# EAGLE schematic Pure Sequencer (EAGLE 8.7.0)
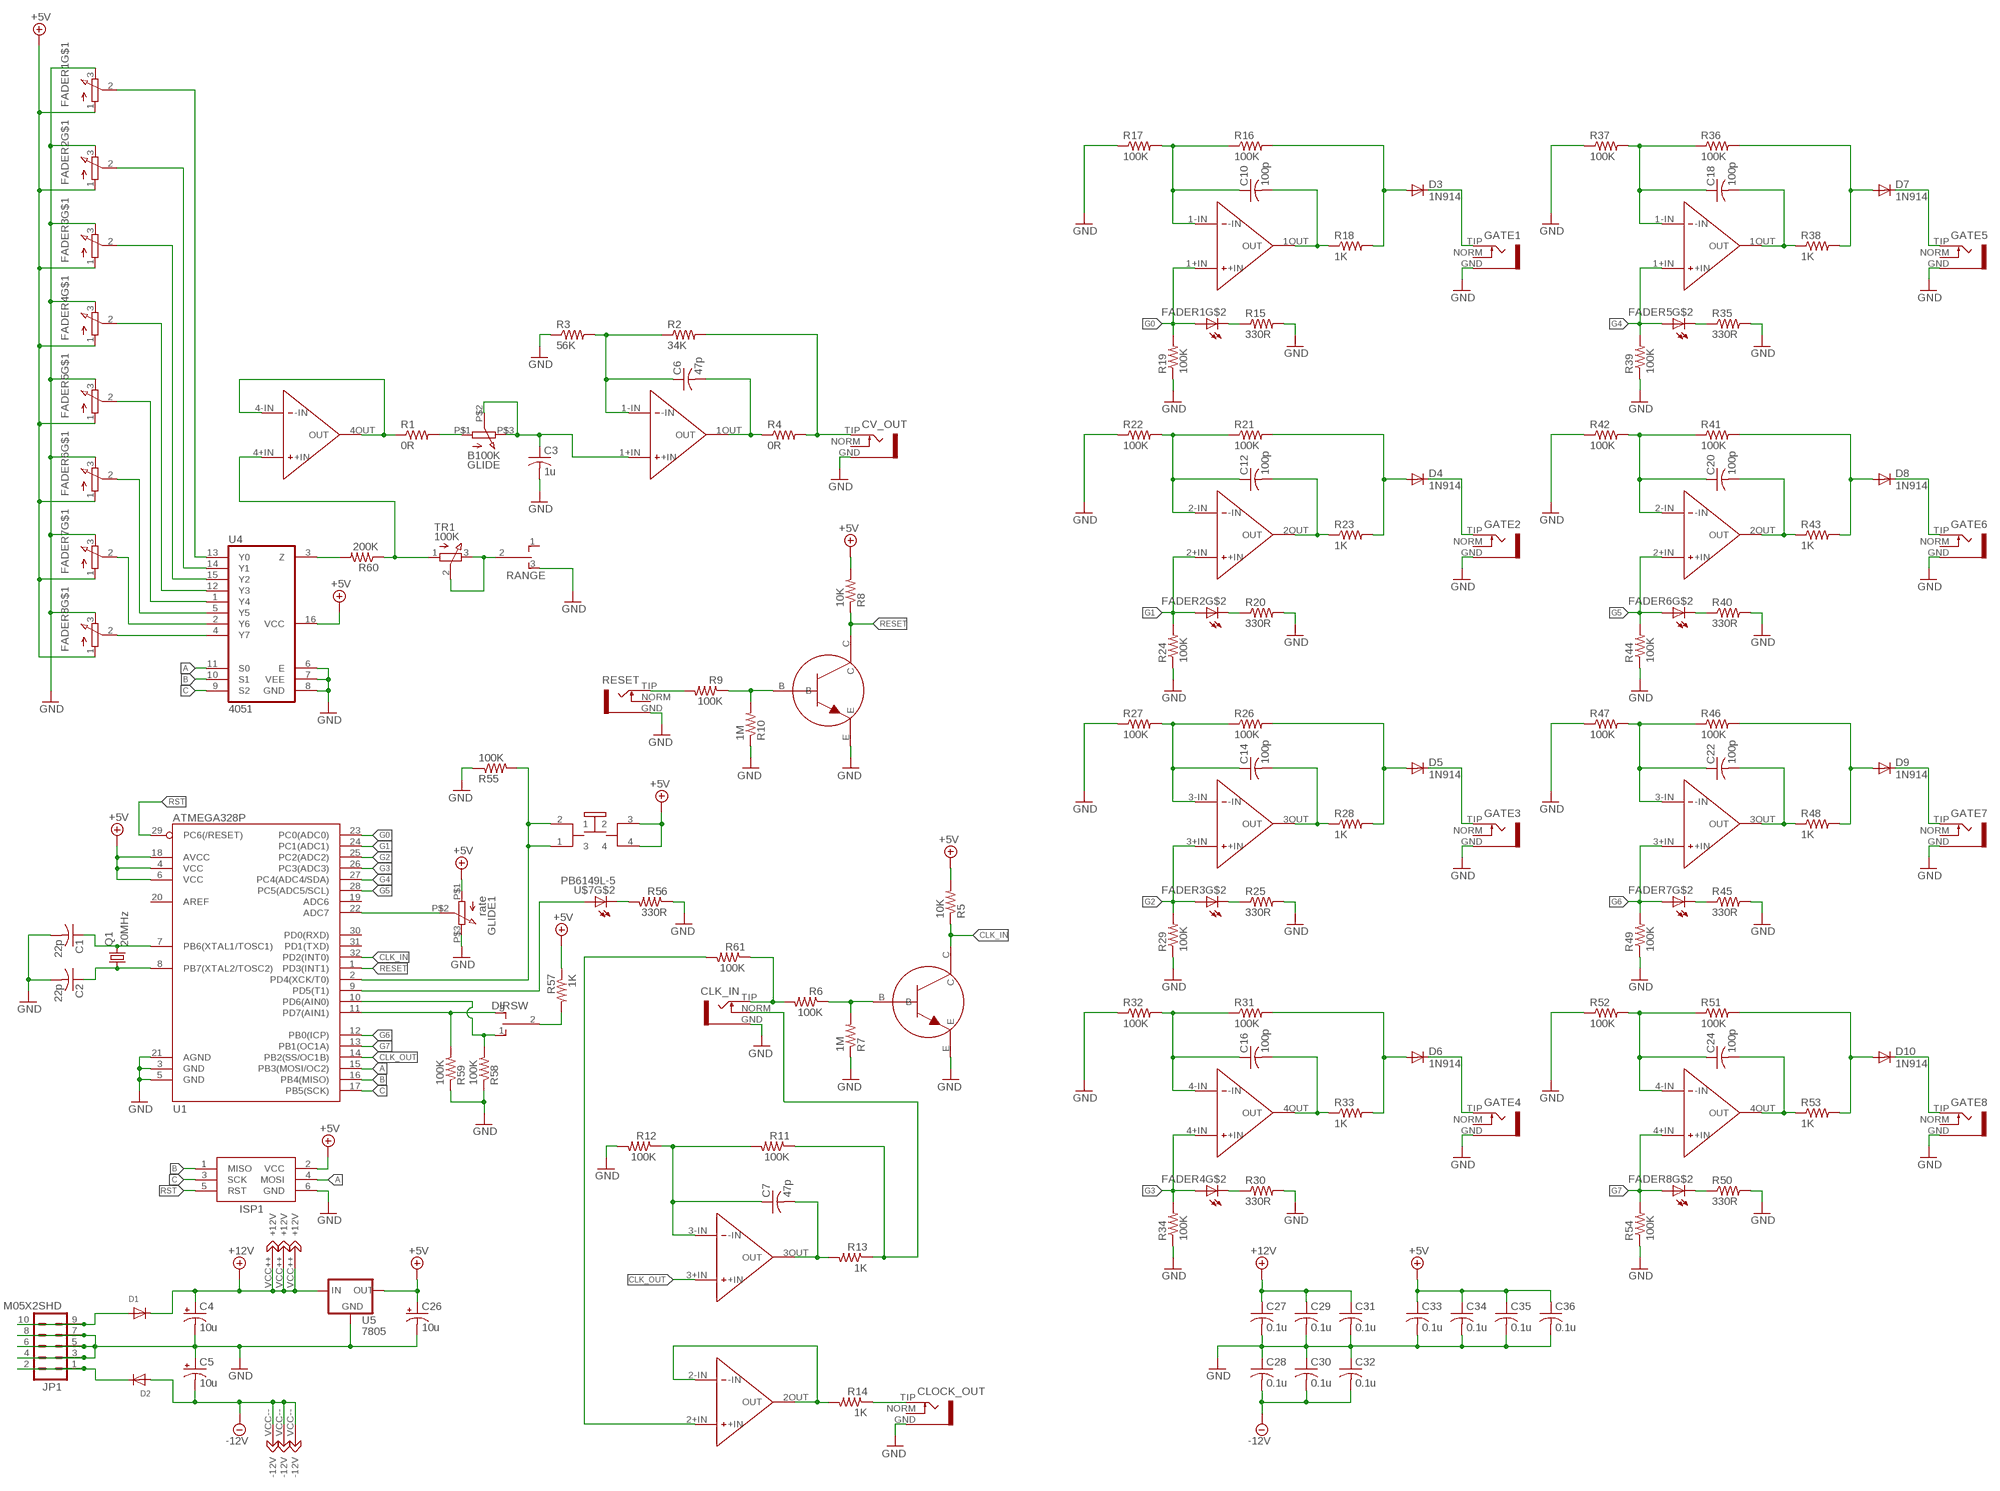
[diagram p0: schematic, sheet 1]

## Parts
C1  22p  C-USC0805K  [C0805K]
C2  22p  C-USC0805K  [C0805K]
C3  1u  C-USC0805K  [C0805K]
C4  10u  CPOL-US153CLV-0505  [153CLV-0505]
C5  10u  CPOL-US153CLV-0505  [153CLV-0505]
C6  47p  C-USC0805K  [C0805K]
C7  47p  C-USC0805K  [C0805K]
C10  100p  C-USC0805K  [C0805K]
C12  100p  C-USC0805K  [C0805K]
C14  100p  C-USC0805K  [C0805K]
C16  100p  C-USC0805K  [C0805K]
C18  100p  C-USC0805K  [C0805K]
C20  100p  C-USC0805K  [C0805K]
C22  100p  C-USC0805K  [C0805K]
C24  100p  C-USC0805K  [C0805K]
C26  10u  CPOL-US153CLV-0505  [153CLV-0505]
C27  0.1u  C-USC0805K  [C0805K]
C28  0.1u  C-USC0805K  [C0805K]
C29  0.1u  C-USC0805K  [C0805K]
C30  0.1u  C-USC0805K  [C0805K]
C31  0.1u  C-USC0805K  [C0805K]
C32  0.1u  C-USC0805K  [C0805K]
C33  0.1u  C-USC0805K  [C0805K]
C34  0.1u  C-USC0805K  [C0805K]
C35  0.1u  C-USC0805K  [C0805K]
C36  0.1u  C-USC0805K  [C0805K]
CLK_IN  S_JACK  [S_JACK]
CLOCK_OUT  S_JACK  [S_JACK]
CV_OUT  S_JACK  [S_JACK]
D1  DIODESMA  [SMADIODE]
D2  DIODESMA  [SMADIODE]
D3  1N914  DIODESOD  [SOD-323]
D4  1N914  DIODESOD  [SOD-323]
D5  1N914  DIODESOD  [SOD-323]
D6  1N914  DIODESOD  [SOD-323]
D7  1N914  DIODESOD  [SOD-323]
D8  1N914  DIODESOD  [SOD-323]
D9  1N914  DIODESOD  [SOD-323]
D10  1N914  DIODESOD  [SOD-323]
DIRSW  TOGGLE_ON_OFF_ON  [TOGGLE_ON_OFF_ON]
FADER1  LED_FADER  [LED_FADER]
FADER2  LED_FADER  [LED_FADER]
FADER3  LED_FADER  [LED_FADER]
FADER4  LED_FADER  [LED_FADER]
FADER5  LED_FADER  [LED_FADER]
FADER6  LED_FADER  [LED_FADER]
FADER7  LED_FADER  [LED_FADER]
FADER8  LED_FADER  [LED_FADER]
GATE1  S_JACK  [S_JACK]
GATE2  S_JACK  [S_JACK]
GATE3  S_JACK  [S_JACK]
GATE4  S_JACK  [S_JACK]
GATE5  S_JACK  [S_JACK]
GATE6  S_JACK  [S_JACK]
GATE7  S_JACK  [S_JACK]
GATE8  S_JACK  [S_JACK]
GLIDE  B100K  Q-POT  [Q-POT]
GLIDE1  rate  Q-POT  [Q-POT]
ISP1  AVRISP-6  [AVRISP]
JP1  M05X2SHD  [2X5-SHROUDED]
Q1  20MHz  CRYSTALHC49UP  [HC49UP]
R1  0R  R-US_R0805  [R0805]
R2  34K  R-US_R0805  [R0805]
R3  56K  R-US_R0805  [R0805]
R4  0R  R-US_R0805  [R0805]
R5  10K  R-US_R0805  [R0805]
R6  100K  R-US_R0805  [R0805]
R7  1M  R-US_R0805  [R0805]
R8  10K  R-US_R0805  [R0805]
R9  100K  R-US_R0805  [R0805]
R10  1M  R-US_R0805  [R0805]
R11  100K  R-US_R0805  [R0805]
R12  100K  R-US_R0805  [R0805]
R13  1K  R-US_R0805  [R0805]
R14  1K  R-US_R0805  [R0805]
R15  330R  R-US_R0805  [R0805]
R16  100K  R-US_R0805  [R0805]
R17  100K  R-US_R0805  [R0805]
R18  1K  R-US_R0805  [R0805]
R19  100K  R-US_R0805  [R0805]
R20  330R  R-US_R0805  [R0805]
R21  100K  R-US_R0805  [R0805]
R22  100K  R-US_R0805  [R0805]
R23  1K  R-US_R0805  [R0805]
R24  100K  R-US_R0805  [R0805]
R25  330R  R-US_R0805  [R0805]
R26  100K  R-US_R0805  [R0805]
R27  100K  R-US_R0805  [R0805]
R28  1K  R-US_R0805  [R0805]
R29  100K  R-US_R0805  [R0805]
R30  330R  R-US_R0805  [R0805]
R31  100K  R-US_R0805  [R0805]
R32  100K  R-US_R0805  [R0805]
R33  1K  R-US_R0805  [R0805]
R34  100K  R-US_R0805  [R0805]
R35  330R  R-US_R0805  [R0805]
R36  100K  R-US_R0805  [R0805]
R37  100K  R-US_R0805  [R0805]
R38  1K  R-US_R0805  [R0805]
R39  100K  R-US_R0805  [R0805]
R40  330R  R-US_R0805  [R0805]
R41  100K  R-US_R0805  [R0805]
R42  100K  R-US_R0805  [R0805]
R43  1K  R-US_R0805  [R0805]
R44  100K  R-US_R0805  [R0805]
R45  330R  R-US_R0805  [R0805]
R46  100K  R-US_R0805  [R0805]
R47  100K  R-US_R0805  [R0805]
R48  1K  R-US_R0805  [R0805]
R49  100K  R-US_R0805  [R0805]
R50  330R  R-US_R0805  [R0805]
R51  100K  R-US_R0805  [R0805]
R52  100K  R-US_R0805  [R0805]
R53  1K  R-US_R0805  [R0805]
R54  100K  R-US_R0805  [R0805]
R55  100K  R-US_R0805  [R0805]
R56  330R  R-US_R0805  [R0805]
R57  1K  R-US_R0805  [R0805]
R58  100K  R-US_R0805  [R0805]
R59  100K  R-US_R0805  [R0805]
R60  200K  R-US_R0805  [R0805]
R61  100K  R-US_R0805  [R0805]
RANGE  TOGGLE_ON_OFF_ON  [TOGGLE_ON_OFF_ON]
RESET  S_JACK  [S_JACK]
T1  2N3904  TRANSISTOR_MMBT3904  [TRANSISTOR_SINGLE_N-TYPE]
T2  2N3904  TRANSISTOR_MMBT3904  [TRANSISTOR_SINGLE_N-TYPE]
TR1  100K  TRIMMER_TH3  [TRIMMER_TH3]
U1  ATMEGA328P  ATMEGA328_SMT  [TQFP32-08]
U2  QUAD_OPAMP  [QUAD_OPAMP]
U3  QUAD_OPAMP  [QUAD_OPAMP]
U4  4051  MUX!  [N2222_ARRAY]
U5  7805  V-REG  [V-REG]
U6  QUAD_OPAMP  [QUAD_OPAMP]
U$7  PB6149L-5  [PB6149L]

## Nets
+5V: C26.+ C33.1 C34.1 C35.1 C36.1 FADER1.1 FADER2.1 FADER3.1 FADER4.1 FADER5.1 FADER6.1 FADER7.1 FADER8.1 GLIDE1.P$1 ISP1.2(VCC) R5.2 R8.2 R57.1 U1.4(VCC) U1.6(VCC) U1.18(AVCC) U4.16(VCC) U5.3(OUT) U$7.3 U$7.4
+12V: C4.+ C27.1 C29.1 C31.1 D1.C U2.VCC++(+12V) U3.VCC++(+12V) U5.1(IN) U6.VCC++(+12V)
-12V: C5.- C28.2 C30.2 C32.2 D2.A U2.VCC--(-12V) U3.VCC--(-12V) U6.VCC--(-12V)
A: ISP1.4(MOSI) U1.15(PB3(MOSI/OC2)) U4.11(S0)
B: ISP1.1(MISO) U1.16(PB4(MISO)) U4.10(S1)
C: ISP1.3(SCK) U1.17(PB5(SCK)) U4.9(S2)
CLK_IN: R5.1 T1.C U1.32(PD2(INT0))
CLK_OUT: U1.14(PB2(SS/OC1B)) U6.3+IN(+IN)
G0: FADER1.A R19.2 U1.23(PC0(ADC0)) U2.1+IN(+IN)
G1: FADER2.A R24.2 U1.24(PC1(ADC1)) U2.2+IN(+IN)
G2: FADER3.A R29.2 U1.25(PC2(ADC2)) U2.3+IN(+IN)
G3: FADER4.A R34.2 U1.26(PC3(ADC3)) U2.4+IN(+IN)
G4: FADER5.A R39.2 U1.27(PC4(ADC4/SDA)) U3.1+IN(+IN)
G5: FADER6.A R44.2 U1.28(PC5(ADC5/SCL)) U3.2+IN(+IN)
G6: FADER7.A R49.2 U1.12(PB0(ICP)) U3.3+IN(+IN)
G7: FADER8.A R54.2 U1.13(PB1(OC1A)) U3.4+IN(+IN)
GND: C1.2 C2.2 C3.2 C4.- C5.+ C26.- C27.2 C28.1 C29.2 C30.1 C31.2 C32.1 C33.2 C34.2 C35.2 C36.2 CLK_IN.GND CLOCK_OUT.GND CV_OUT.GND FADER1.3 FADER2.3 FADER3.3 FADER4.3 FADER5.3 FADER6.3 FADER7.3 FADER8.3 GATE1.GND GATE2.GND GATE3.GND GATE4.GND GATE5.GND GATE6.GND GATE7.GND GATE8.GND GLIDE1.P$3 ISP1.6(GND) JP1.3 JP1.4 JP1.5 JP1.6 JP1.7 JP1.8 R3.1 R7.1 R10.1 R12.2 R15.2 R17.1 R19.1 R20.2 R22.1 R24.1 R25.2 R27.1 R29.1 R30.2 R32.1 R34.1 R35.2 R37.1 R39.1 R40.2 R42.1 R44.1 R45.2 R47.1 R49.1 R50.2 R52.1 R54.1 R55.1 R56.1 R58.1 R59.1 RANGE.3(S) RESET.GND T1.E T2.E U1.3(GND) U1.5(GND) U1.21(AGND) U4.6(E) U4.7(VEE) U4.8(GND) U5.4(GND)
N$1: C1.1 Q1.2 U1.7(PB6(XTAL1/TOSC1))
N$2: C2.1 Q1.1 U1.8(PB7(XTAL2/TOSC2))
N$3: R60.1 TR1.1 U6.4+IN(+IN)
N$4: R1.1 U6.4-IN(-IN) U6.4OUT(OUT)
N$5: GLIDE.P$1 R1.2
N$6: FADER8.2 U4.4(Y7)
N$7: FADER7.2 U4.2(Y6)
N$8: FADER6.2 U4.5(Y5)
N$9: D1.A JP1.9 JP1.10
N$10: D2.C JP1.1 JP1.2
N$11: FADER5.2 U4.1(Y4)
N$12: FADER4.2 U4.12(Y3)
N$13: FADER3.2 U4.15(Y2)
N$14: FADER2.2 U4.14(Y1)
N$15: FADER1.2 U4.13(Y0)
N$16: C3.1 GLIDE.P$2 GLIDE.P$3 U6.1+IN(+IN)
N$17: R6.1 R7.2 T1.B
N$18: R61.2 U6.2+IN(+IN)
N$19: C6.1 R2.1 R3.2 U6.1-IN(-IN)
N$20: C6.2 R4.1 U6.1OUT(OUT)
N$21: CV_OUT.TIP R2.2 R4.2
N$22: R9.1 R10.2 T2.B
N$23: R9.2 RESET.TIP
N$24: C7.1 R11.2 R12.1 U6.3-IN(-IN)
N$25: C7.2 R13.2 U6.3OUT(OUT)
N$26: CLK_IN.TIP R6.2 R61.1
N$27: R14.2 U6.2-IN(-IN) U6.2OUT(OUT)
N$28: CLOCK_OUT.TIP R14.1
N$29: CLK_IN.NORM R11.1 R13.1
N$30: GLIDE1.P$2 U1.22(ADC7)
N$31: FADER1.K(C) R15.1
N$32: C10.1 R16.1 R17.2 U2.1-IN(-IN)
N$33: C10.2 R18.1 U2.1OUT(OUT)
N$34: D3.2(A) R16.2 R18.2
N$35: FADER3.K(C) R25.1
N$36: FADER2.K(C) R20.1
N$37: C12.1 R21.1 R22.2 U2.2-IN(-IN)
N$38: C12.2 R23.1 U2.2OUT(OUT)
N$39: D4.2(A) R21.2 R23.2
N$40: C14.1 R26.1 R27.2 U2.3-IN(-IN)
N$41: C14.2 R28.1 U2.3OUT(OUT)
N$42: D5.2(A) R26.2 R28.2
N$43: FADER4.K(C) R30.1
N$44: C16.1 R31.1 R32.2 U2.4-IN(-IN)
N$45: C16.2 R33.1 U2.4OUT(OUT)
N$46: D6.2(A) R31.2 R33.2
N$47: FADER5.K(C) R35.1
N$48: C18.1 R36.1 R37.2 U3.1-IN(-IN)
N$49: C18.2 R38.1 U3.1OUT(OUT)
N$50: D7.2(A) R36.2 R38.2
N$51: FADER6.K(C) R40.1
N$52: C20.1 R41.1 R42.2 U3.2-IN(-IN)
N$53: C20.2 R43.1 U3.2OUT(OUT)
N$54: D8.2(A) R41.2 R43.2
N$55: FADER7.K(C) R45.1
N$56: C22.1 R46.1 R47.2 U3.3-IN(-IN)
N$57: C22.2 R48.1 U3.3OUT(OUT)
N$58: D9.2(A) R46.2 R48.2
N$59: FADER8.K(C) R50.1
N$60: C24.1 R51.1 R52.2 U3.4-IN(-IN)
N$61: C24.2 R53.1 U3.4OUT(OUT)
N$62: D10.2(A) R51.2 R53.2
N$63: R55.2 U1.2(PD4(XCK/T0)) U$7.1 U$7.2
N$64: U1.9(PD5(T1)) U$7.A
N$65: R56.2 U$7.K(C)
N$66: DIRSW.2(P) R57.2
N$67: DIRSW.1(O) R58.2 U1.10(PD6(AIN0))
N$68: DIRSW.3(S) R59.2 U1.11(PD7(AIN1))
N$69: R60.2 U4.3(Z)
N$70: RANGE.2(P) TR1.2 TR1.3
N$71: D6.1(C) GATE4.TIP
N$72: D5.1(C) GATE3.TIP
N$73: D4.1(C) GATE2.TIP
N$74: D3.1(C) GATE1.TIP
N$75: D10.1(C) GATE8.TIP
N$76: D9.1(C) GATE7.TIP
N$77: D8.1(C) GATE6.TIP
N$78: D7.1(C) GATE5.TIP
RESET: R8.1 T2.C U1.1(PD3(INT1))
RST: ISP1.5(RST) U1.29(PC6(/RESET))
Unconnected: CLOCK_OUT.NORM CV_OUT.NORM GATE1.NORM GATE2.NORM GATE3.NORM GATE4.NORM GATE5.NORM GATE6.NORM GATE7.NORM GATE8.NORM RANGE.1(O) RESET.NORM U1.19(ADC6) U1.20(AREF) U1.30(PD0(RXD)) U1.31(PD1(TXD))

## Library data of the parts
C1-C3 C6 C7 C10 C12 C14 C16 C18 C20 C22 C24 C27-C36 = rcl:C-US: CAPACITOR, American symbol
C4 C5 C26 = rcl:CPOL-US: POLARIZED CAPACITOR, American symbol
CLK_IN CLOCK_OUT CV_OUT GATE1-GATE8 RESET = INSTRUO:S_JACK
D1 D2 = adafruit:DIODE: Diode
D3-D10 = SparkFun-DiscreteSemi:DIODE: Diode
DIRSW RANGE = INSTRUO:TOGGLE_ON_OFF_ON
FADER1-FADER8 = INSTRUO:LED_FADER
GLIDE GLIDE1 = INSTRUO:Q-POT
ISP1 = adafruit:AVRISP: AVR ISP HEADER Standard 6 pin header for AVR programming
JP1 = SparkFun-Connectors:M05X2: Header 5x2 Standard 10-pin dual row 0.1" header. Commonly used with AVR-ISP. Use with Spark Fun Electronics SKU: PRT-00778
Q1 = adafruit:CRYSTAL: CRYSTAL; OC_FARNELL: unknown; OC_NEWARK: unknown
R1-R61 = rcl:R-US_: RESISTOR, American symbol
T1 T2 = INSTRUO:TRANSISTOR_MMBT3904
TR1 = INSTRUO:TRIMMER_TH3
U1 = SparkFun-DigitalIC:ATMEGA328_SMT: 32-Pin Atmega328 part Commonly used on Arduino compatible boards Available in QFP and QFN packages TQFP is IC-09069 QFN is non-stock; PROD_ID: IC-09069
U2 U3 U6 = INSTRUO:QUAD_OPAMP
U4 = INSTRUO:MUX!
U5 = INSTRUO:V-REG
U$7 = INSTRUO:PB6149L-5